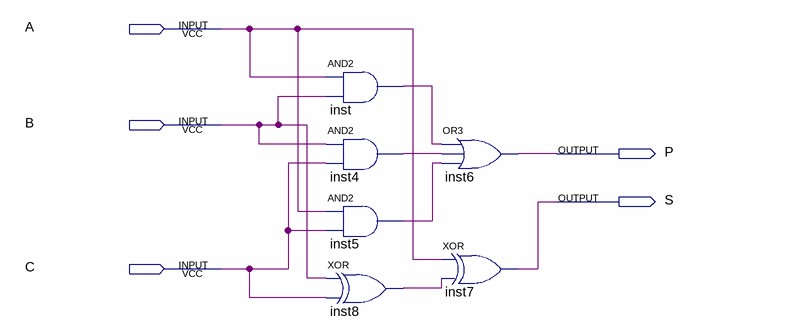
[diagram p0: schematic sheet]
// Quartus schematic SUM.bdf as structural Verilog: 6 symbols, 5 pins
module SUM (
  input  A,
  input  B,
  input  C,
  output P,
  output S
);

  wire inst4_out, inst5_out, inst8_out, inst_out;

  and inst (inst_out, A, B);
  and inst4 (inst4_out, B, C);
  and inst5 (inst5_out, A, C);
  xor inst8 (inst8_out, B, C);
  or inst6 (P, inst_out, inst4_out, inst5_out);
  xor inst7 (S, A, inst8_out);
endmodule
